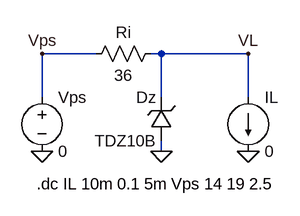
[diagram p0: schematic 8-2-5-b-1.asc]
8-2-5-b-1.asc, the LTspice schematic file:
Version 4
SHEET 1 880 680
WIRE 96 128 16 128
WIRE 192 128 176 128
WIRE 320 128 192 128
WIRE 16 192 16 128
WIRE 192 192 192 128
WIRE 320 192 320 128
WIRE 192 272 192 256
FLAG 320 272 0
FLAG 16 272 0
FLAG 192 272 0
FLAG 320 128 VL
FLAG 16 128 Vps
SYMBOL voltage 16 176 R0
WINDOW 123 0 0 Left 0
WINDOW 39 0 0 Left 0
SYMATTR InstName Vps
SYMATTR Value 0
SYMBOL current 320 192 R0
WINDOW 123 0 0 Left 0
WINDOW 39 0 0 Left 0
SYMATTR InstName IL
SYMATTR Value 0
SYMBOL res 192 112 R90
WINDOW 0 0 56 VBottom 2
WINDOW 3 32 56 VTop 2
SYMATTR InstName Ri
SYMATTR Value 36
SYMBOL zener 208 256 R180
WINDOW 0 24 64 Left 2
WINDOW 3 24 0 Left 2
SYMATTR InstName Dz
SYMATTR Value TDZ10B
TEXT 8 320 Left 2 !.dc IL 10m 0.1 5m Vps 14 19 2.5

The netlist it stands for:
* 8-2-5-b-1.asc
Vps Vps 0 0
IL VL 0 0
Ri VL Vps 36
Dz 0 VL TDZ10B
.model D D
.lib standard.dio
.dc IL 10m 0.1 5m Vps 14 19 2.5
.backanno
.end